# EAGLE design IEEEAdapter_v2 (EAGLE 7.5.0)
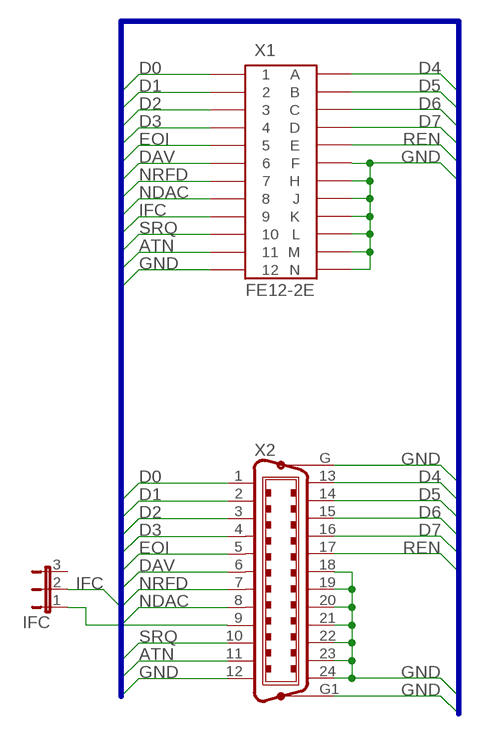
[diagram p0: schematic, sheet 1]

## Parts
IFC  JP2E  [JP2]
X1  FE12-2E  [FE12-2_SHORT]
X2  C24HP  [24HP]

## Nets
ATN: X1.11 X2.11
D0: X1.1 X2.1
D1: X1.2 X2.2
D2: X1.3 X2.3
D3: X1.4 X2.4
D4: X1.A X2.13
D5: X1.B X2.14
D6: X1.C X2.15
D7: X1.D X2.16
DAV: X1.6 X2.6
EOI: X1.5 X2.5
GND: X1.12 X1.F X1.H X1.J X1.K X1.L X1.M X1.N X2.12 X2.18 X2.19 X2.20 X2.21 X2.22 X2.23 X2.24 X2.G X2.G1
IFC: IFC.2 X1.9
N$1: IFC.1 X2.9
NDAC: X1.8 X2.8
NRFD: X1.7 X2.7
REN: X1.E X2.17
SRQ: X1.10 X2.10
Unconnected: IFC.3

## Buses
D0,D1,D2,D3,EOI,DAV,NRFD,NDAC,IFC,SRQ,ATN,CHASSIS_GND,D4,D5,D6,D7,REN,GND

## Library data of the parts
IFC = jumper:JP2E: JUMPER
X1 = con-edge-156:FE12-2
X2 = con-amp-champ:C24HP: CONNECTOR; OC_FARNELL: unknown; OC_NEWARK: unknown

## Board
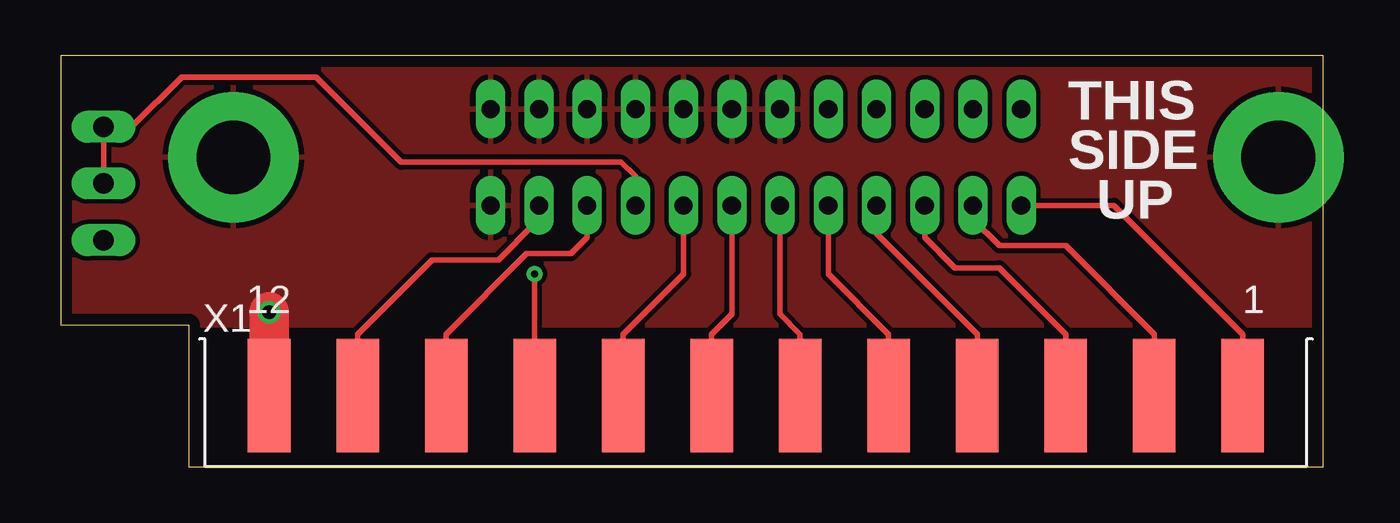
[diagram p1: board, top side]
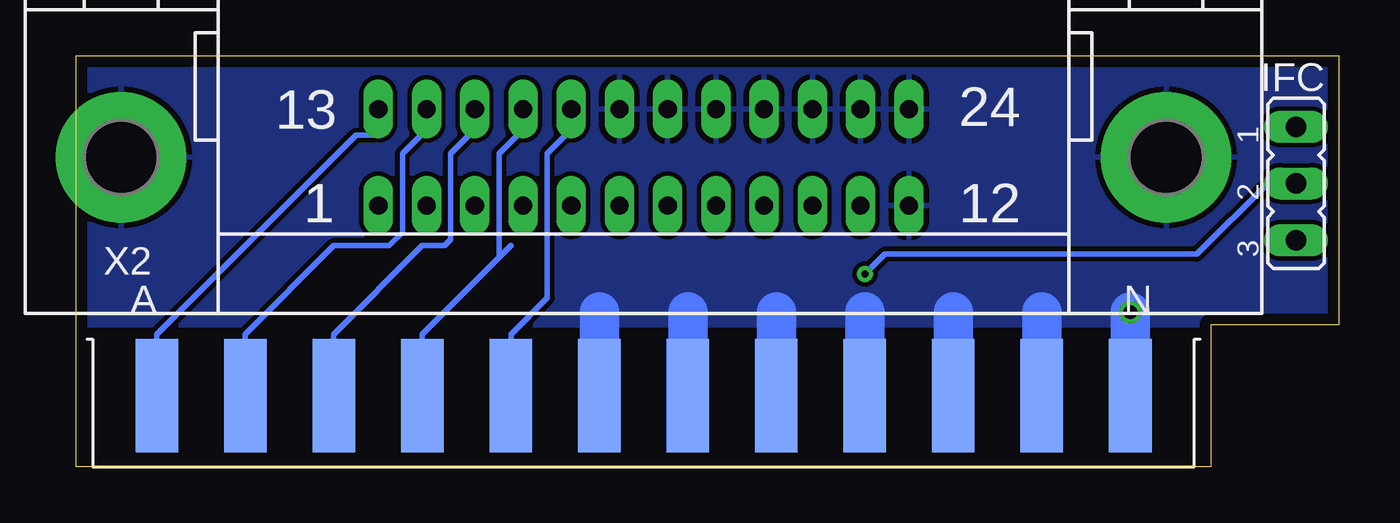
[diagram p2: board, bottom side, seen from below]

Size 56.52 x 18.41 mm. Coordinates in mm from the lower left corner, seen from the top.
Outline: 5.71,0 56.52,0 56.52,18.41 0,18.41 0,6.35 5.71,6.35 5.71,0
Copper layers (1*16): Top 0.035mm / dielectric 1.5mm / Bottom 0.035mm
Design rules "default *": minimum track width 10mil, minimum drill 12mil, track to track 8mil, track to pad 8mil, pad to pad 8mil, via to via 8mil, smd to smd 8mil, copper to edge 20mil, drill to drill 8mil, minimum pad ring 10mil, minimum via ring 8mil, stop-mask expansion 4mil, vias tented up to drill 0mil, thermal gap 10mil

### Footprints (pad centres in the part's own frame; a part is rotated, then mirrored left to right if it is on the bottom)
JP2 = drill 0.914 long: 1 -2.54,0; 2 0,0; 3 2.54,0
FE12-2_SHORT = smd 1.905 x 5.08: 1 -21.793,-0.216; 2 -17.831,-0.216; 3 -13.868,-0.216; 4 -9.906,-0.216; 5 -5.944,-0.216; 6 -1.981,-0.216; 7 1.981,-0.216; 8 5.944,-0.216; 9 9.906,-0.216; 10 13.868,-0.216; 11 17.831,-0.216; 12 21.793,-0.216 | smd 1.905 x 5.08 bottom: A -21.793,-0.216; B -17.831,-0.216; C -13.868,-0.216; D -9.906,-0.216; E -5.944,-0.216; F -1.981,-0.216; H 1.981,-0.216; J 5.944,-0.216; K 9.906,-0.216; L 13.868,-0.216; M 17.831,-0.216; N 21.793,-0.216
24HP = drill 0.813 long: 1 -11.874,-2.159; 2 -9.716,-2.159; 3 -7.556,-2.159; 4 -5.397,-2.159; 5 -3.239,-2.159; 6 -1.079,-2.159; 7 1.079,-2.159; 8 3.239,-2.159; 9 5.397,-2.159; 10 7.556,-2.159; 11 9.716,-2.159; 12 11.874,-2.159; 13 -11.874,2.159; 14 -9.716,2.159; 15 -7.556,2.159; 16 -5.397,2.159; 17 -3.239,2.159; 18 -1.079,2.159; 19 1.079,2.159; 20 3.239,2.159; 21 5.397,2.159; 22 7.556,2.159; 23 9.716,2.159; 24 11.874,2.159 | drill 3.302 pad 5.842: G -23.393,0; G1 23.393,0

### Placement (x,y rotation side)
IFC  1.9,12.7 270 bottom
X1  31.11,2.97 180 top
X2  31.11,13.87 0 bottom

### Tracks (layer width: path | path; a pad name or v marks a point on that pad's centre or on a via)
ATN
  Top 0.254: X1.11 13.28,5.94 16.61,9.27 19.58,9.27 21.21,10.9 21.21,11.52 X2.11
D0
  Top 0.254: X1.1 52.91,5.94 47.14,11.71 X2.1
D1
  Top 0.254: X1.2 48.95,5.94 44.98,9.91 42.01,9.91 40.83,11.09 X2.2
D2
  Top 0.254: X1.3 44.98,5.94 42.01,8.91 40.03,8.91 38.67,10.27 X2.3
D3
  Top 0.254: X1.4 41.02,5.94 36.51,10.45 X2.4
D4
  Bottom 0.254: X1.A 52.91,5.94 43.99,14.86 43.24,14.86 42.99,15.11 X2.13
D5
  Bottom 0.254: X1.B 48.95,5.94 44.98,9.91 42.51,9.91 41.91,10.5 41.91,14.03 40.83,15.11 X2.14
D6
  Bottom 0.254: X1.C 44.98,5.94 41.02,9.91 40.03,9.91 39.75,10.19 39.75,14.03 38.67,15.11 X2.15
D7
  Bottom 0.254: X1.D 41.02,5.94 37.55,9.41 | 37.55,9.41 37.06,9.91 | X2.16 36.51,15.11 37.59,14.03 37.59,9.45 37.55,9.41
DAV
  Top 0.254: X1.6 33.1,5.94 32.2,6.84 X2.6
EOI
  Top 0.254: X1.5 37.06,5.94 34.35,8.65 X2.5
GND  (via drill 0.61)
  Top 1.778: X1.12 v9.32,6.93
  Bottom 1.778: v9.32,6.93 X1.12 | X1.M 13.28,6.93 | X1.L 17.25,6.93 | X1.K 21.21,6.93 | X1.J 25.17,6.93 | X1.H 29.13,6.93 | X1.F 33.1,6.93
  pour Top: 0,18.41 56.52,18.41 56.52,6.35 0,6.35
  pour Bottom: 0,18.41 56.52,18.41 56.52,6.35 0,6.35
IFC  (via drill 0.3)
  Top 0.254: X1.9 v21.21,8.64
  Bottom 0.254: IFC.2 3.17,12.7 6.35,9.53 20.32,9.53 v21.21,8.64
N$1
  Top 0.254: X2.9 25.72,13.02 25.08,13.65 15.24,13.65 11.43,17.46 5.4,17.46 3.17,15.24 IFC.1
N$2
  Top 0.254: 1.9,15.24 1.9,12.7
NDAC
  Top 0.254: X1.8 25.17,5.94 27.88,8.65 X2.8
NRFD
  Top 0.254: X1.7 29.13,5.94 30.04,6.84 X2.7
REN
  Bottom 0.254: X1.E 37.06,5.94 35.43,7.57 35.43,14.03 34.35,15.11 X2.17
SRQ
  Top 0.254: X1.10 17.25,5.94 20.85,9.55 22.84,9.55 23.56,10.27 X2.10

### Text on the board
tNames: THIS | SIDE | UP
tValues: www.go4retro.com | PET<->IEEE Adapter